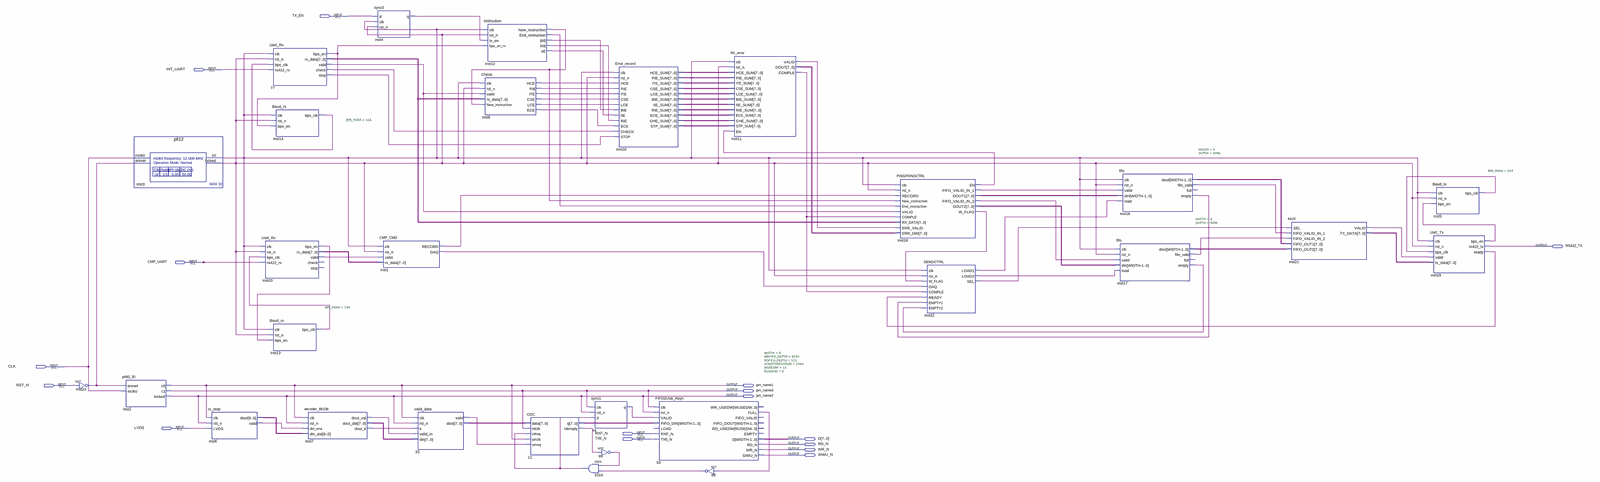
[diagram p0: schematic sheet, whole]
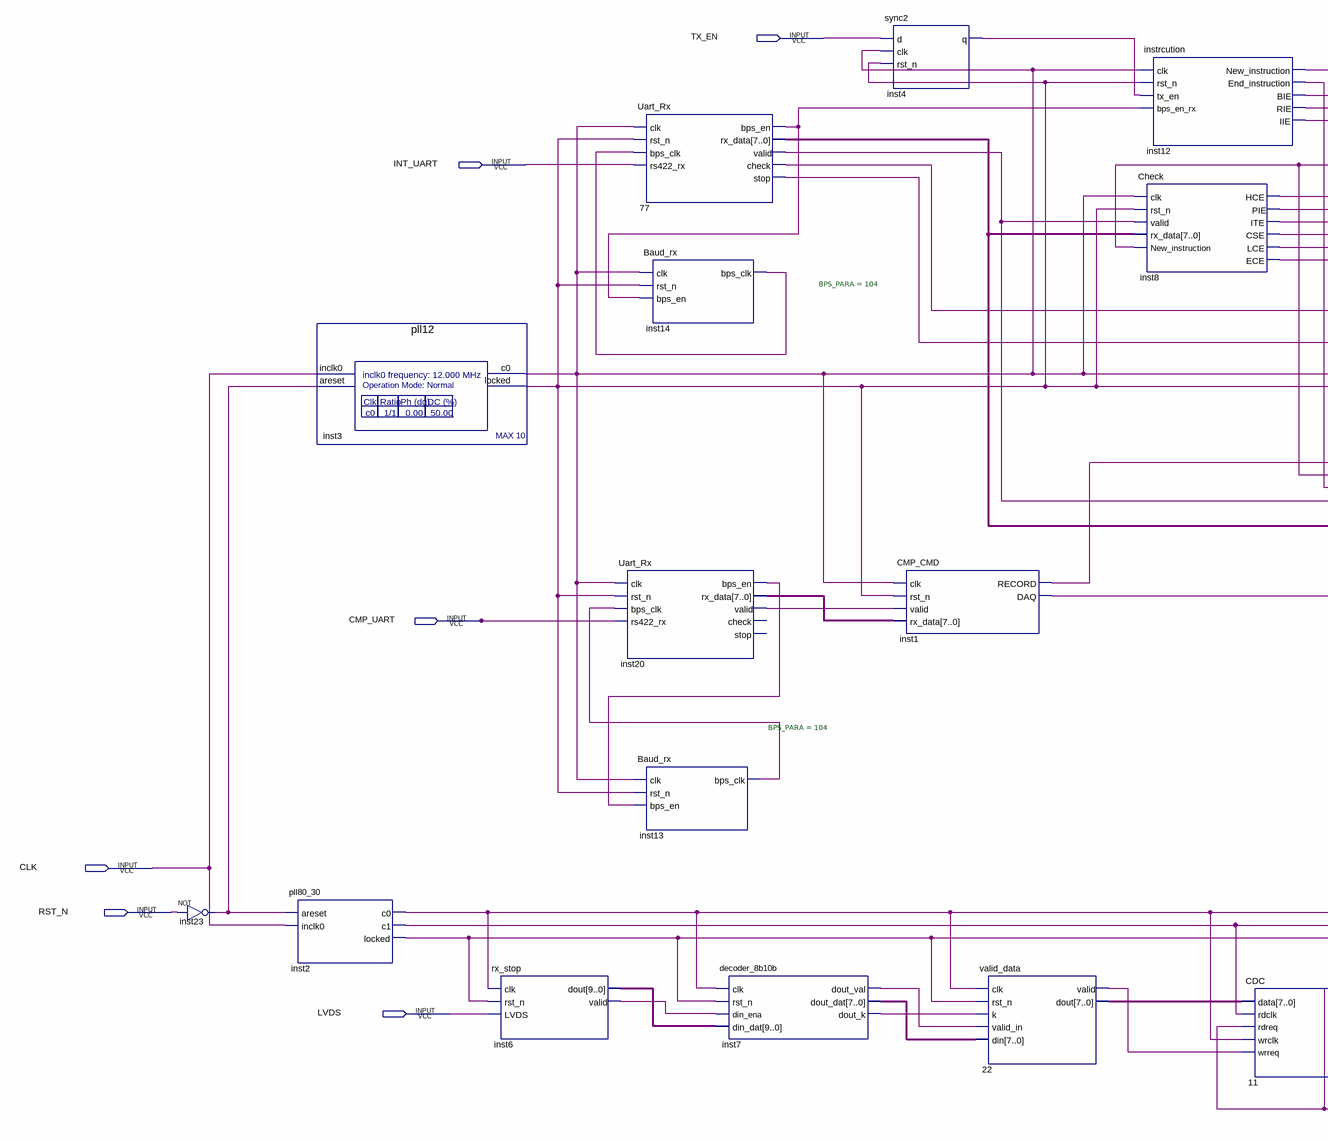
[diagram p1: schematic sheet, left part]
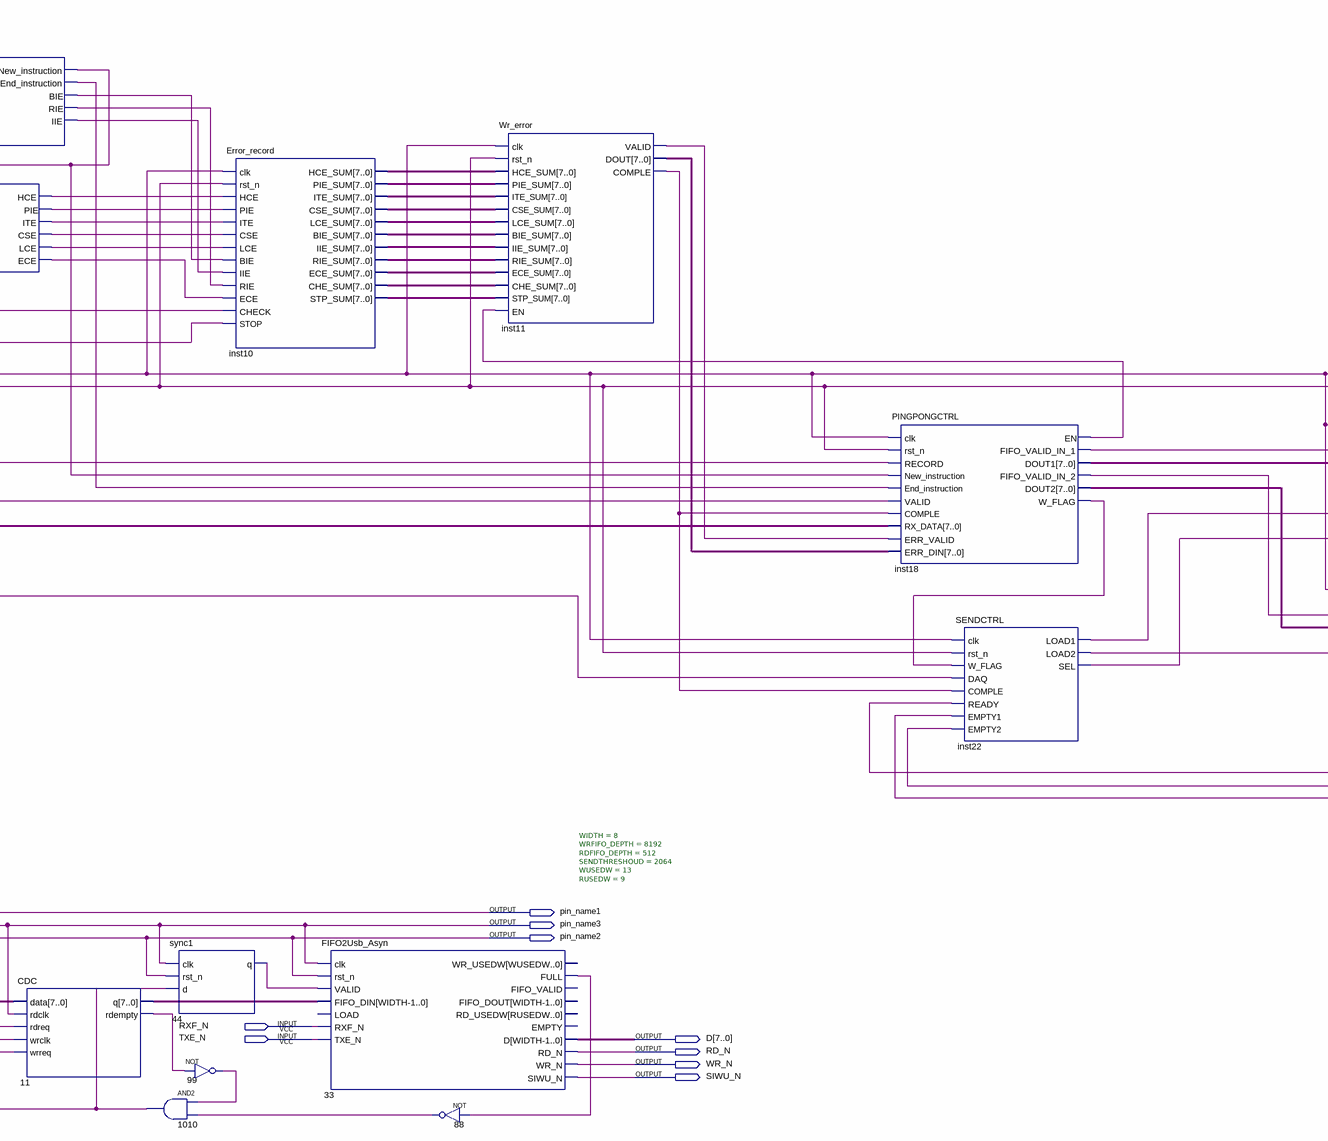
[diagram p2: schematic sheet, centre part]
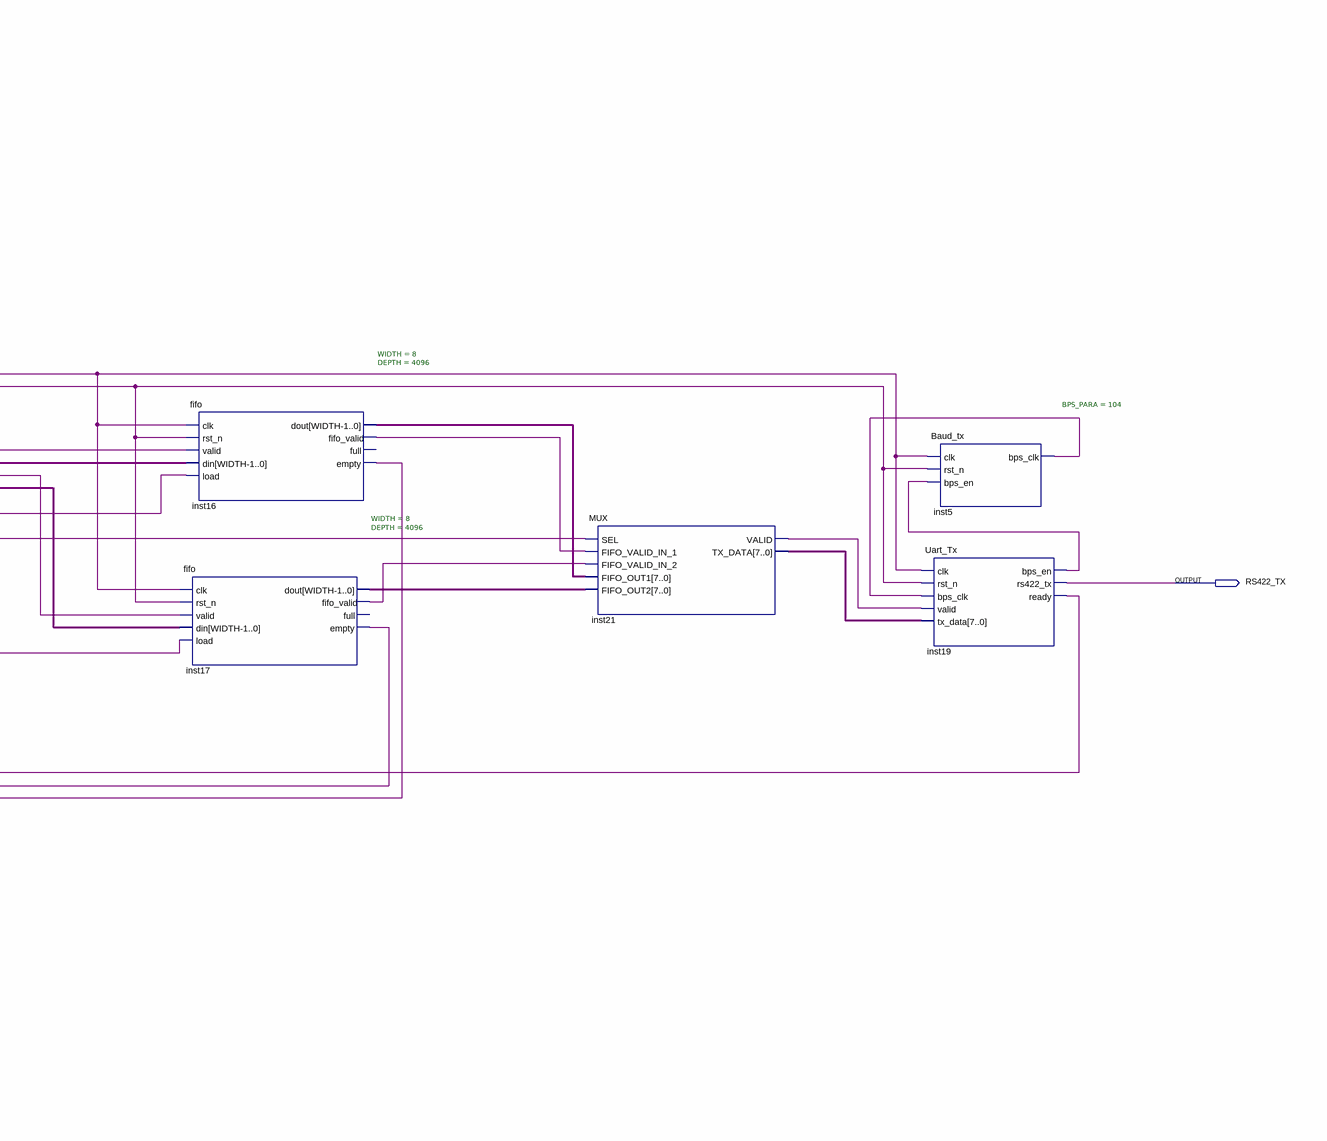
[diagram p3: schematic sheet, right part]
// Quartus schematic BACKUPCHECK.bdf as structural Verilog: 29 symbols, 16 pins
module BACKUPCHECK (
  input  TX_EN,
  input  INT_UART,
  input  CMP_UART,
  input  CLK,
  input  RST_N,
  input  LVDS,
  input  RXF_N,
  input  TXE_N,
  output RS422_TX,
  output pin_name1,
  output pin_name3,
  output pin_name2,
  output [7:0] D,
  output RD_N,
  output WR_N,
  output SIWU_N
);

  wire inst1_daq, inst1_record, inst3_c0, inst3_locked, inst4_q, inst5_bps_clk, inst6_valid, inst7_dout_k,
       inst7_dout_val, inst8_cse, inst8_ece, inst8_hce, inst8_ite, inst8_lce, inst8_pie, inst11_comple,
       inst11_valid, inst12_bie, inst12_end_instruction, inst12_iie, inst12_new_instruction, inst12_rie,
       inst13_bps_clk, inst14_bps_clk, inst16_empty, inst16_fifo_valid, inst17_empty, inst17_fifo_valid,
       inst18_en, inst18_fifo_valid_in_1, inst18_fifo_valid_in_2, inst18_w_flag, inst19_bps_en, inst19_ready,
       inst20_bps_en, inst20_valid, inst21_valid, inst22_load1, inst22_load2, inst22_sel, inst23_out,
       n11_rdempty, n22_valid, n33_full, n44_q, n77_bps_en, n77_check, n77_stop, n77_valid, n88_out, n99_out,
       n1010_out;
  wire [7:0] inst7_dout_dat, inst10_bie_sum, inst10_che_sum, inst10_cse_sum, inst10_ece_sum, inst10_hce_sum,
       inst10_iie_sum, inst10_ite_sum, inst10_lce_sum, inst10_pie_sum, inst10_rie_sum, inst10_stp_sum,
       inst11_dout, inst16_dout, inst17_dout, inst18_dout1, inst18_dout2, inst20_rx_data, inst21_tx_data,
       n11_q, n22_dout, n77_rx_data;
  wire [9:0] inst6_dout;

  not inst23 (inst23_out, RST_N);
  pll80_30 inst2 (.areset(inst23_out), .inclk0(CLK), .c0(pin_name1), .c1(pin_name3), .locked(pin_name2));
  pll12 inst3 (.inclk0(CLK), .areset(inst23_out), .c0(inst3_c0), .locked(inst3_locked));
  rx_stop inst6 (.clk(pin_name1), .rst_n(pin_name2), .LVDS(LVDS), .dout(inst6_dout), .valid(inst6_valid));
  Uart_Rx u_77 (
    .clk(inst3_c0), .rst_n(inst3_locked), .bps_clk(inst14_bps_clk), .rs422_rx(INT_UART), .bps_en(n77_bps_en),
    .rx_data(n77_rx_data), .valid(n77_valid), .check(n77_check), .stop(n77_stop));
  Baud_rx #(.BPS_PARA(104)) inst14 (
    .clk(inst3_c0), .rst_n(inst3_locked), .bps_en(n77_bps_en), .bps_clk(inst14_bps_clk));
  Uart_Rx inst20 (
    .clk(inst3_c0), .rst_n(inst3_locked), .bps_clk(inst13_bps_clk), .rs422_rx(CMP_UART),
    .bps_en(inst20_bps_en), .rx_data(inst20_rx_data), .valid(inst20_valid));  // open: check, stop
  Baud_rx #(.BPS_PARA(104)) inst13 (
    .clk(inst3_c0), .rst_n(inst3_locked), .bps_en(inst20_bps_en), .bps_clk(inst13_bps_clk));
  decoder_8b10b inst7 (
    .clk(pin_name1), .rst_n(pin_name2), .din_ena(inst6_valid), .din_dat(inst6_dout),
    .dout_val(inst7_dout_val), .dout_dat(inst7_dout_dat), .dout_k(inst7_dout_k));
  sync2 inst4 (.d(TX_EN), .clk(inst3_c0), .rst_n(inst3_locked), .q(inst4_q));
  CMP_CMD inst1 (
    .clk(inst3_c0), .rst_n(inst3_locked), .valid(inst20_valid), .rx_data(inst20_rx_data),
    .RECORD(inst1_record), .DAQ(inst1_daq));
  valid_data u_22 (
    .clk(pin_name1), .rst_n(pin_name2), .k(inst7_dout_k), .valid_in(inst7_dout_val), .din(inst7_dout_dat),
    .valid(n22_valid), .dout(n22_dout));
  instrcution inst12 (
    .clk(inst3_c0), .rst_n(inst3_locked), .tx_en(inst4_q), .bps_en_rx(n77_bps_en),
    .New_instruction(inst12_new_instruction), .End_instruction(inst12_end_instruction), .BIE(inst12_bie),
    .RIE(inst12_rie), .IIE(inst12_iie));
  Check inst8 (
    .clk(inst3_c0), .rst_n(inst3_locked), .valid(n77_valid), .rx_data(n77_rx_data),
    .New_instruction(inst12_new_instruction), .HCE(inst8_hce), .PIE(inst8_pie), .ITE(inst8_ite),
    .CSE(inst8_cse), .LCE(inst8_lce), .ECE(inst8_ece));
  CDC u_11 (
    .data(n22_dout), .rdclk(pin_name3), .rdreq(n1010_out), .wrclk(pin_name1), .wrreq(n22_valid), .q(n11_q),
    .rdempty(n11_rdempty));
  sync1 u_44 (.clk(pin_name3), .rst_n(pin_name2), .d(n1010_out), .q(n44_q));
  and u_1010 (n1010_out, n99_out, n88_out);
  Error_record inst10 (
    .clk(inst3_c0), .rst_n(inst3_locked), .HCE(inst8_hce), .PIE(inst8_pie), .ITE(inst8_ite), .CSE(inst8_cse),
    .LCE(inst8_lce), .BIE(inst12_bie), .IIE(inst12_iie), .RIE(inst12_rie), .ECE(inst8_ece),
    .CHECK(n77_check), .STOP(n77_stop), .HCE_SUM(inst10_hce_sum), .PIE_SUM(inst10_pie_sum),
    .ITE_SUM(inst10_ite_sum), .CSE_SUM(inst10_cse_sum), .LCE_SUM(inst10_lce_sum), .BIE_SUM(inst10_bie_sum),
    .IIE_SUM(inst10_iie_sum), .RIE_SUM(inst10_rie_sum), .ECE_SUM(inst10_ece_sum), .CHE_SUM(inst10_che_sum),
    .STP_SUM(inst10_stp_sum));
  not u_99 (n99_out, n11_rdempty);
  FIFO2Usb_Asyn #(.WIDTH(8), .WRFIFO_DEPTH(8192), .RDFIFO_DEPTH(512), .SENDTHRESHOUD(2064), .WUSEDW(13), .RUSEDW(9)) u_33 (
    .clk(pin_name3), .rst_n(pin_name2), .VALID(n44_q), .FIFO_DIN(n11_q), .RXF_N(RXF_N), .TXE_N(TXE_N),
    .FULL(n33_full), .RD_N(RD_N), .WR_N(WR_N), .SIWU_N(SIWU_N), .D(D));  // open: LOAD, WR_USEDW, FIFO_VALID, FIFO_DOUT, RD_USEDW, EMPTY
  not u_88 (n88_out, n33_full);
  Wr_error inst11 (
    .clk(inst3_c0), .rst_n(inst3_locked), .HCE_SUM(inst10_hce_sum), .PIE_SUM(inst10_pie_sum),
    .ITE_SUM(inst10_ite_sum), .CSE_SUM(inst10_cse_sum), .LCE_SUM(inst10_lce_sum), .BIE_SUM(inst10_bie_sum),
    .IIE_SUM(inst10_iie_sum), .RIE_SUM(inst10_rie_sum), .ECE_SUM(inst10_ece_sum), .CHE_SUM(inst10_che_sum),
    .STP_SUM(inst10_stp_sum), .EN(inst18_en), .VALID(inst11_valid), .DOUT(inst11_dout), .COMPLE(inst11_comple));
  PINGPONGCTRL inst18 (
    .clk(inst3_c0), .rst_n(inst3_locked), .RECORD(inst1_record), .New_instruction(inst12_new_instruction),
    .End_instruction(inst12_end_instruction), .VALID(n77_valid), .COMPLE(inst11_comple),
    .RX_DATA(n77_rx_data), .ERR_VALID(inst11_valid), .ERR_DIN(inst11_dout), .EN(inst18_en),
    .FIFO_VALID_IN_1(inst18_fifo_valid_in_1), .DOUT1(inst18_dout1), .FIFO_VALID_IN_2(inst18_fifo_valid_in_2),
    .DOUT2(inst18_dout2), .W_FLAG(inst18_w_flag));
  SENDCTRL inst22 (
    .clk(inst3_c0), .rst_n(inst3_locked), .W_FLAG(inst18_w_flag), .DAQ(inst1_daq), .COMPLE(inst11_comple),
    .READY(inst19_ready), .EMPTY1(inst16_empty), .EMPTY2(inst17_empty), .LOAD1(inst22_load1),
    .LOAD2(inst22_load2), .SEL(inst22_sel));
  fifo #(.WIDTH(8), .DEPTH(4096)) inst16 (
    .clk(inst3_c0), .rst_n(inst3_locked), .valid(inst18_fifo_valid_in_1), .din(inst18_dout1),
    .load(inst22_load1), .dout(inst16_dout), .fifo_valid(inst16_fifo_valid), .empty(inst16_empty));  // open: full
  fifo #(.WIDTH(8), .DEPTH(4096)) inst17 (
    .clk(inst3_c0), .rst_n(inst3_locked), .valid(inst18_fifo_valid_in_2), .din(inst18_dout2),
    .load(inst22_load2), .dout(inst17_dout), .fifo_valid(inst17_fifo_valid), .empty(inst17_empty));  // open: full
  MUX inst21 (
    .SEL(inst22_sel), .FIFO_VALID_IN_1(inst16_fifo_valid), .FIFO_VALID_IN_2(inst17_fifo_valid),
    .FIFO_OUT1(inst16_dout), .FIFO_OUT2(inst17_dout), .VALID(inst21_valid), .TX_DATA(inst21_tx_data));
  Baud_tx #(.BPS_PARA(104)) inst5 (
    .clk(inst3_c0), .rst_n(inst3_locked), .bps_en(inst19_bps_en), .bps_clk(inst5_bps_clk));
  Uart_Tx inst19 (
    .clk(inst3_c0), .rst_n(inst3_locked), .bps_clk(inst5_bps_clk), .valid(inst21_valid),
    .tx_data(inst21_tx_data), .bps_en(inst19_bps_en), .rs422_tx(RS422_TX), .ready(inst19_ready));
endmodule
